# Altium schematic sheet VFD LCD.SchDoc
size A3; SheetNumber: 1; SheetTotal: 3
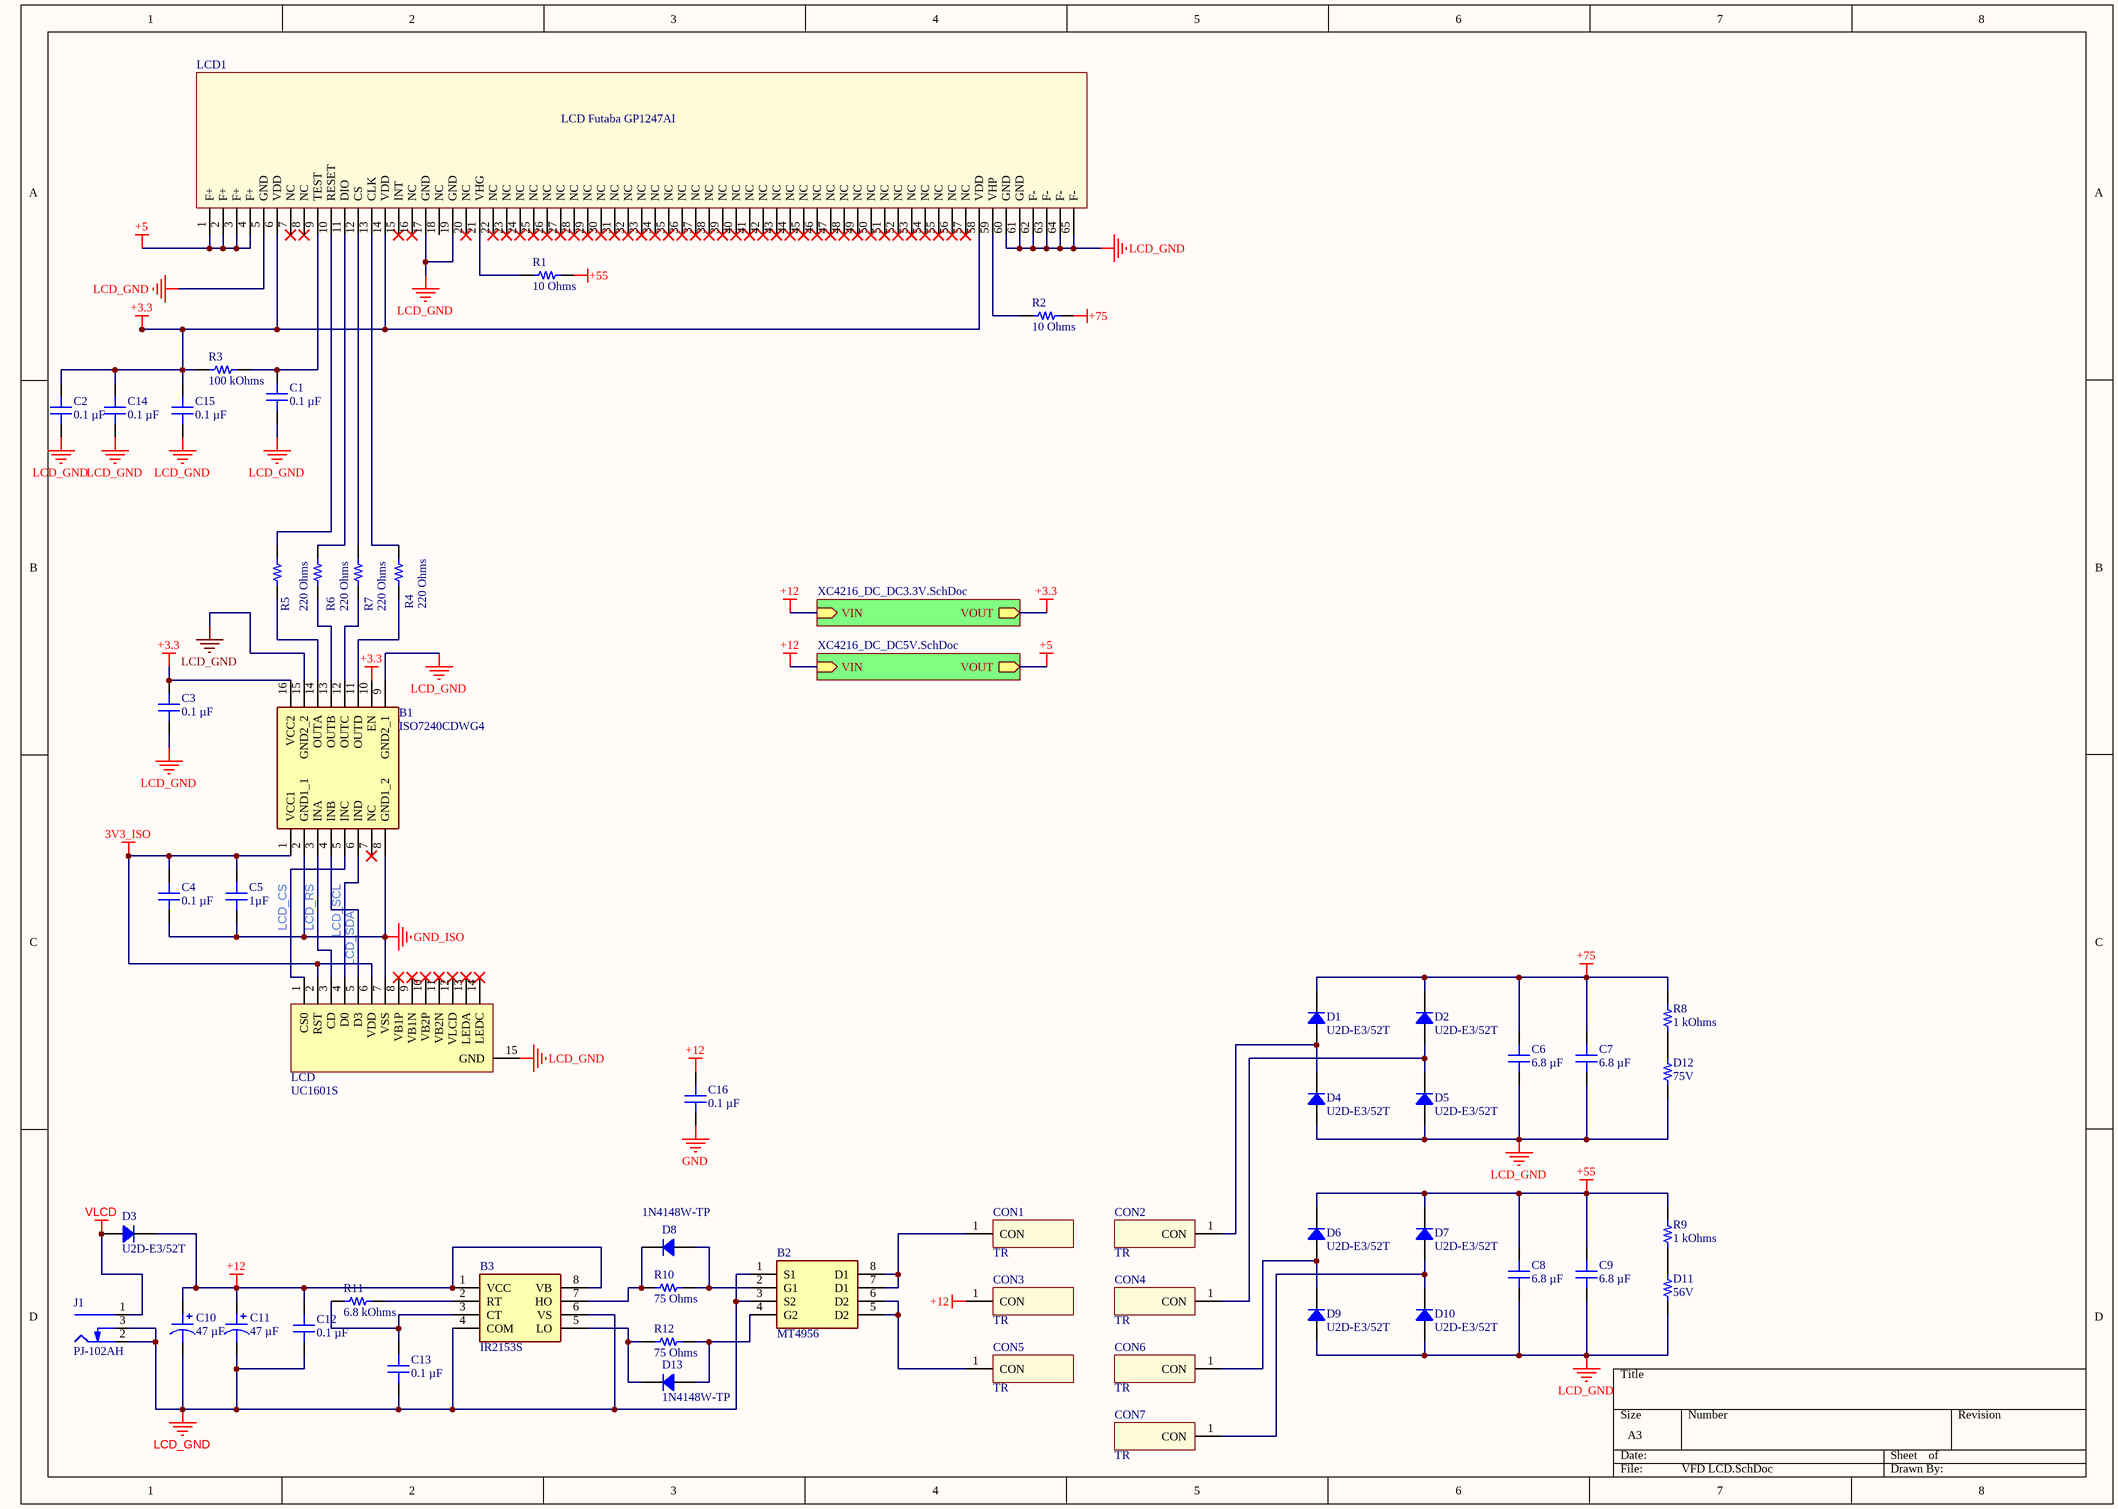
[diagram p0: VFD LCD.SchDoc]

## Parts
B1  ISO7240CDWG4  [SOIC127P1030X265-16N]
B2  MT4956  [SOIC127P600X175-8N]
B3  IR2153S  [SOIC127P600X175-8N]
C1  0.1 µF  [CAP 0805_2012]
C2  0.1 µF  [CAP 0805_2012]
C3  0.1 µF  [CAP 0805_2012]
C4  0.1 µF  [CAP 0805_2012]
C5  1µF  [CAP 0805_2012]
C6  6.8 µF  [CAP 1210_3225 - 1MM]
C7  6.8 µF  [CAP 1210_3225 - 1MM]
C8  6.8 µF  [CAP 1210_3225 - 1MM]
C9  6.8 µF  [CAP 1210_3225 - 1MM]
C10  47 µF  [CAP ALSMD 8.3MM H10.5MM]
C11  47 µF  [CAP ALSMD 8.3MM H10.5MM]
C12  0.1 µF  [CAP 1206_3216 - 0.8MM]
C13  0.1 µF  [CAP 1206_3216 - 0.8MM]
C14  0.1 µF  [CAP 0805_2012]
C15  0.1 µF  [CAP 0805_2012]
C16  0.1 µF  [CAP 1206_3216 - 0.8MM]
CON1  TR  [one contact 0,8_1.6]
CON2  TR  [one contact 0,8_1.6]
CON3  TR  [one contact 0,8_1.6]
CON4  TR  [one contact 0,8_1.6]
CON5  TR  [one contact 0,8_1.6]
CON6  TR  [one contact 0,8_1.6]
CON7  TR  [one contact 0,8_1.6]
D1  U2D-E3/52T  [DO214AA SMB]
D2  U2D-E3/52T  [DO214AA SMB]
D3  U2D-E3/52T  [DO214AA SMB]
D4  U2D-E3/52T  [DO214AA SMB]
D5  U2D-E3/52T  [DO214AA SMB]
D6  U2D-E3/52T  [DO214AA SMB]
D7  U2D-E3/52T  [DO214AA SMB]
D8  1N4148W-TP  [SOD-123]
D9  U2D-E3/52T  [DO214AA SMB]
D10  U2D-E3/52T  [DO214AA SMB]
D11  56V  [RES 1206_3216]
D12  75V  [RES 1206_3216]
D13  1N4148W-TP  [SOD-123]
J1  PJ-102AH  [CUI PJ-102AH]
LCD  UC1601S  [FPC0514]
LCD1  GP1247AI  [GP1247AI]  (value not drawn)
R1  10 Ohms  [RES 1206_3216]
R2  10 Ohms  [RES 1206_3216]
R3  100 kOhms  [RES 0805_2012]
R4  220 Ohms  [RES 0805_2012]
R5  220 Ohms  [RES 0805_2012]
R6  220 Ohms  [RES 0805_2012]
R7  220 Ohms  [RES 0805_2012]
R8  1 kOhms  [RES 1206_3216]
R9  1 kOhms  [RES 1206_3216]
R10  75 Ohms  [RES 0805_2012]
R11  6.8 kOhms  [RES 1206_3216]
R12  75 Ohms  [RES 0805_2012]

## Sub-sheets
U_XC4216_DC_DC3.3V = XC4216_DC_DC3.3V.SchDoc: VIN (in), VOUT (out)
U_XC4216_DC_DC5V = XC4216_DC_DC5V.SchDoc: VIN (in), VOUT (out)

## Nets
3V3_ISO: B1.1(VCC1) C4.1 C5.2 LCD.2(RST) LCD.6(VDD)
+3.3: B1.10(EN) B1.16(VCC2) C2.2 C3.1 C14.2 C15.2 LCD1.6(VDD) LCD1.14(VDD) LCD1.58(VDD) R3.1 ; sheet U_XC4216_DC_DC3.3V/VOUT
+5: LCD1.1(F+) LCD1.2(F+) LCD1.3(F+) LCD1.4(F+) ; sheet U_XC4216_DC_DC5V/VOUT
+12: B3.1(VCC) B3.8(VB) C10.1 C11.1 C12.2 C16.2 CON3.1(CON) D3.2 ; sheet U_XC4216_DC_DC3.3V/VIN, sheet U_XC4216_DC_DC5V/VIN
+55: C8.2 C9.2 D6.2 D7.2 R1.2 R9.2
+75: C6.2 C7.2 D1.2 D2.2 R2.2 R8.2
GND: C16.1
GND_ISO: B1.2(GND1_1) B1.8(GND1_2) C4.2 C5.1 LCD.7(VSS)
LCD_GND: B1.9(GND2_1) B1.15(GND2_2) B2.1(S1) B2.3(S2) B3.4(COM) B3.6(VS) C1.1 C2.1 C3.2 C6.1 C7.1 C8.1 C9.1 C10.2 C11.2 C12.1 C13.1 C14.1 C15.1 D4.1 D5.1 D9.1 D10.1 D11.1 D12.1 J1.2(Outer) J1.3(SW) LCD.15(GND) LCD1.5(GND) LCD1.17(GND) LCD1.19(GND) LCD1.60(GND) LCD1.61(GND) LCD1.62(F-) LCD1.63(F-) LCD1.64(F-) LCD1.65(F-)
VLCD: D3.1 J1.1(Centre)
LCD_CS: B1.5(INC) LCD.1(CS0)
LCD_RS: B1.3(INA) LCD.3(CD)
LCD_SCL: B1.6(IND) LCD.4(D0)
LCD_SDA: B1.4(INB) LCD.5(D3)
NetB1_11: B1.11(OUTD) R4.1
NetB1_12: B1.12(OUTC) R7.1
NetB1_13: B1.13(OUTB) R6.1
NetB1_14: B1.14(OUTA) R5.1
NetB2_2: B2.2(G1) D8.1 R10.2
NetB2_4: B2.4(G2) D13.1 R12.2
NetB2_5: B2.5(D2) B2.6(D2) CON5.1(CON)
NetB2_7: B2.7(D1) B2.8(D1) CON1.1(CON)
NetB3_2: B3.2(RT) R11.2
NetB3_3: B3.3(CT) C13.2 R11.1
NetB3_5: B3.5(LO) D13.2 R12.1
NetB3_7: B3.7(HO) D8.2 R10.1
NetC1_2: C1.2 LCD1.9(TEST) R3.2
NetCON2_1: CON2.1(CON) D1.1 D4.2
NetCON4_1: CON4.1(CON) D2.1 D5.2
NetCON6_1: CON6.1(CON) D6.1 D9.2
NetCON7_1: CON7.1(CON) D7.1 D10.2
NetD11_2: D11.2 R9.1
NetD12_2: D12.2 R8.1
NetLCD1_10: LCD1.10(RESET) R5.2
NetLCD1_11: LCD1.11(DIO) R6.2
NetLCD1_12: LCD1.12(CS) R7.2
NetLCD1_13: LCD1.13(CLK) R4.2
NetLCD1_21: LCD1.21(VHG) R1.1
NetLCD1_59: LCD1.59(VHP) R2.1

Not connected (* = marked no-connect by the designer): B1 7(NC)*; LCD 8(VB1P)* 9(VB1N)* 10(VB2P)* 11(VB2N)* 12(VLCD)* 13(LEDA)* 14(LEDC)*; LCD1 7(NC)* 8(NC)* 15(INT)* 16(NC)* 18(NC) 20(NC)* 22(NC)* 23(NC)* 24(NC)* 25(NC)* 26(NC)* 27(NC)* 28(NC)* 29(NC)* 30(NC)* 31(NC)* 32(NC)* 33(NC)* 34(NC)* 35(NC)* 36(NC)* 37(NC)* 38(NC)* 39(NC)* 40(NC)* 41(NC)* 42(NC)* 43(NC)* 44(NC)* 45(NC)* 46(NC)* 47(NC)* 48(NC)* 49(NC)* 50(NC)* 51(NC)* 52(NC)* 53(NC)* 54(NC)* 55(NC)* 56(NC)* 57(NC)*

## Notes on the sheet
- (in symbol GP1247AI) LCD Futaba GP1247AI

## Library data of the parts
B1 = ISO7240CDWG4: Digital Isolator CMOS 4-CH 25Mbps 16-Pin SOIC Tube; Manufacturer_Name: Texas Instruments; Geometry.Height: 2.65mm; Manufacturer_Part_Number: ISO7240CDWG4; Mouser Part Number: 595-ISO7240CDWG4; Mouser Price/Stock: https://www.mouser.co.uk/ProductDetail/Texas-Instruments/ISO7240CDWG4?qs=IUbkBnfnSQLQBn7aUd6cPA%3D%3D; Arrow Part Number: ISO7240CDWG4; Arrow Price/Stock: https://www.arrow.com/en/products/iso7240cdwg4/texas-instruments; Datasheet Link: https://www.ti.com/lit/ds/symlink/iso7240c.pdf?ts=1635751768423&ref_url=https%253A%252F%252Fwww.ti.com%252Fproduct%252FISO7240C
B2 = MT4956: N-Channel PowerTrench® MOSFET / 60V, 5A, mΩ; Manufacturer_Name: Infineon; Manufacturer_Part_Number: IR2153S; Geometry.Height: 1.75mm; Mouser Part Number: *; Mouser Price/Stock: *; Arrow Part Number: *; Arrow Price/Stock: *; Datasheet Link: http://www.infineon.com/dgdl/ir2153.pdf?fileId=5546d462533600a4015355c8c5fc16af
B3 = IR2153S: Self-Oscillating 600 V Half Bridge Driver IC with typical 0 A source and 0 A sink currents in 8 Lead SOIC package for IGBTs and MOSFETs. Also available in 8 Lead PDIP.; Manufacturer_Name: Infineon; Geometry.Height: 1.75mm; Manufacturer_Part_Number: IR2153S; Mouser Part Number: *; Mouser Price/Stock: *; Arrow Part Number: *; Arrow Price/Stock: *; Datasheet Link: http://www.infineon.com/dgdl/ir2153.pdf?fileId=5546d462533600a4015355c8c5fc16af
C1-C4 C14 C15 = CC0805MRX7R9BB104: CAP CER 0.1UF 50V X7R 0805; manufacturer: Yageo; Tolerance: ±20%; Part Number: CC0805MRX7R9BB104; Value: 0.1 µF; Applications: General Purpose; Capacitance: 0.1 µF; componentlink1description: Datasheet; componentlink1url: https://www.yageo.com/upload/media/product/productsearch/datasheet/mlcc/UPY-GPHC_X7R_6.3V-to-50V_18.pdf; componentlink2description: DigiKey Link; componentlink2url: https://www.digikey.com/en/products/detail/yageo/CC0805MRX7R9BB104/5884281; Device Package: 0805 (2012 Metric); lastupdated: 8/26/2023 7:12:59 PM; Lifecycle Status: Active; Minimum Order: 1; Mounting Type: Surface Mount, MLCC; Operating Temperature: -55°C ~ 125°C; Package / Case: 0805 (2012 Metric); packaging: TapeAndReel; partid: 2475; Part Status: Active; price: 0.01; series: CC; Size / Dimension: 0.079" L x 0.049" W (2.00mm x 1.25mm); Supplier 1: DigiKey; Supplier Part Number 1: 311-4351-1-ND; Temperature Coefficient: X7R; Thickness (Max): 0.037" (0.95mm); Voltage - Rated: 50V
C5 = MM05ZC105KCZ2A: CAP CER 1UF 10V X7R 0805; manufacturer: AVX Corporation; Tolerance: ±10%; Part Number: MM05ZC105KCZ2A; Value: 1µF; Applications: Medical, Non-Critical; Capacitance: 1µF; componentlink1description: Datasheet; componentlink1url: http://datasheets.avx.com/AVX-MM.pdf; componentlink2description: DigiKey Link; componentlink2url: http://digikey.com/product-detail/en/avx-corporation/MM05ZC105KCZ2A/478-10611-1-ND/7344872; Device Package: 0805 (2012 Metric); lastupdated: 9/2/2020 1:04:42 AM; Lifecycle Status: Active; Minimum Order: 1; Mounting Type: Surface Mount, MLCC; Operating Temperature: -55°C ~ 125°C; Package / Case: 0805 (2012 Metric); packaging: TapeAndReel; partid: 2439; Part Status: Active; price: 0.50; series: MM; Size / Dimension: 0.079" L x 0.049" W (2.01mm x 1.25mm); Supplier 1: DigiKey; Supplier Part Number 1: 478-10611-1-ND; Temperature Coefficient: X7R; Thickness (Max): 0.029" (0.74mm); Voltage - Rated: 10V
C6-C9 = CGA6P3X7S1H685K250AB: CAP CER 6.8UF 50V X7S 1210; manufacturer: TDK Corporation; Tolerance: ±10%; Part Number: CGA6P3X7S1H685K250AB; Value: 6.8 µF; Applications: Automotive; Capacitance: 6.8 µF; componentlink1description: Datasheet; componentlink1url: https://product.tdk.com/info/en/catalog/datasheets/mlcc_automotive_general_en.pdf?ref_disty=digikey; componentlink2description: DigiKey Link; componentlink2url: https://www.digikey.com/en/products/detail/tdk-corporation/CGA6P3X7S1H685K250AB/2672896; Device Package: 1210 (3225 Metric); lastupdated: 6/4/2024 7:21:03 PM; Lifecycle Status: Active; Minimum Order: 1; Mounting Type: Surface Mount, MLCC; Operating Temperature: -55°C ~ 125°C; Package / Case: 1210 (3225 Metric); packaging: TapeAndReel; partid: 23852; Part Status: Active; price: 0.32; Ratings: AEC-Q200; series: CGA; Size / Dimension: 0.126" L x 0.098" W (3.20mm x 2.50mm); Supplier 1: DigiKey; Supplier Part Number 1: 445-7003-1-ND; Temperature Coefficient: X7S; Thickness (Max): 0.110" (2.80mm); Voltage - Rated: 50V
C10 C11 = 63SGV47M8X10.5: CAP ALUM 47UF 20% 63V SMD; manufacturer: Rubycon; Lifetime @ Temp.: 2000 Hrs @ 105°C; Polarization: Polar; Ripple Current @ High Frequency: 180 mA @ 10 kHz; Ripple Current @ Low Frequency: 120 mA @ 120 Hz; Surface Mount Land Size: 0.327" L x 0.327" W (8.30mm x 8.30mm); Part Number: 63SGV47M8X10.5; Applications: Automotive; Capacitance: 47 µF; componentlink1description: Datasheet; componentlink1url: http://www.rubycon.co.jp/en/catalog/e_pdfs/aluminum/e_sgv.pdf; componentlink2description: DigiKey Link; componentlink2url: https://www.digikey.com/en/products/detail/rubycon/63SGV47M8X10-5/3568703; Device Package: Radial, Can - SMD; Height - Seated (Max): 0.413" (10.50mm); lastupdated: 8/26/2023 8:37:59 PM; Lifecycle Status: Active; Minimum Order: 1; Mounting Type: Surface Mount; Operating Temperature: -40°C ~ 105°C; Package / Case: Radial, Can - SMD; packaging: TapeAndReel; partid: 7644; Part Status: Active; price: 0.20; Ratings: AEC-Q200; series: SGV; Size / Dimension: 0.315" Dia (8.00mm); Supplier 1: DigiKey; Supplier Part Number 1: 1189-2505-1-ND; Tolerance: ±20%; value: 47 µF; Voltage - Rated: 63 V
C12 C13 C16 = CC1206MRY5V9BB104: CAP CER 0.1UF 50V Y5V 1206; manufacturer: Yageo; Temperature Coefficient: Y5V (F); Tolerance: ±20%; Part Number: CC1206MRY5V9BB104; Value: 0.1 µF; Applications: General Purpose; Capacitance: 0.1 µF; componentlink1description: Datasheet; componentlink1url: http://www.yageo.com/documents/recent/UPY-GPHC_Y5V_6.3V-to-50V_8.pdf; componentlink2description: DigiKey Link; componentlink2url: https://www.digikey.com/en/products/detail/yageo/CC1206MRY5V9BB104/5884674; Device Package: 1206 (3216 Metric); lastupdated: 6/4/2024 7:10:39 PM; Lifecycle Status: Active; Minimum Order: 1; Mounting Type: Surface Mount, MLCC; Operating Temperature: -30°C ~ 85°C; Package / Case: 1206 (3216 Metric); packaging: TapeAndReel; partid: 18711; Part Status: Active; price: 0.04; series: CC; Size / Dimension: 0.126" L x 0.063" W (3.20mm x 1.60mm); Supplier 1: DigiKey; Supplier Part Number 1: 311-4504-1-ND; Thickness (Max): 0.028" (0.70mm); Voltage - Rated: 50V
CON1-CON7 = ONE_Contact
D1-D7 D9 D10 = U2D-E3/52T: DIODE GEN PURP 200V 2A DO214AA; Manufacturer: Vishay Semiconductor Diodes Division; Current - Reverse Leakage @ Vr: 10µA @ 200V; Diode Type: Standard; Reverse Recovery Time (trr): 27ns; Speed: Fast Recovery =< 500ns, > 200mA (Io); Voltage - Forward (Vf) (Max) @ If: 900mV @ 2A; Part Number: U2D-E3/52T; ComponentLink1Description: Datasheet; ComponentLink1URL: http://www.vishay.com/docs/89096/u2d.pdf; ComponentLink2Description: DigiKey Link; ComponentLink2URL: http://digikey.com/product-detail/en/vishay-semiconductor-diodes-division/U2D-E3-52T/U2D-E3-52TGICT-ND/9601335; Current - Average Rectified (Io): 2A; LastUpdated: 6/3/2024 7:53:59 PM; Lifecycle Status: Active; Minimum Order: 1; Mounting Type: Surface Mount; Operating Temperature - Junction: -55°C ~ 150°C; Package / Case: DO-214AA, SMB; Packaging: TapeAndReel; PartId: 160; Part Status: Active; Price: 0.19; Series: -; Supplier 1: DigiKey; Supplier Part Number 1: U2D-E3/52TGICT-ND; Supplier Device Package: DO-214AA (SMB); Voltage - DC Reverse (Vr) (Max): 200V
D8 D13 = 1N4148W-TP: DIODE GEN PURP 100V 150MA SOD123; Manufacturer: Micro Commercial Co; Capacitance @ Vr, F: 2pF @ 0V, 1MHz; Current - Reverse Leakage @ Vr: 1 µA @ 75 V; Diode Type: Standard; Reverse Recovery Time (trr): 4 ns; Speed: Small Signal =< 200mA (Io), Any Speed; Voltage - Forward (Vf) (Max) @ If: 1.25 V @ 150 mA; Part Number: 1N4148W-TP; ComponentLink1Description: Datasheet; ComponentLink1URL: https://www.mccsemi.com/pdf/Products/1N4148W(SOD123).pdf; ComponentLink2Description: DigiKey Link; ComponentLink2URL: https://www.digikey.com/en/products/detail/micro-commercial-co/1N4148W-TP/717196; Current - Average Rectified (Io): 150mA; LastUpdated: 6/3/2024 19:54:46; Lifecycle Status: Active; Minimum Order: 1; Mounting Type: Surface Mount; Operating Temperature - Junction: -65°C ~ 150°C; Package / Case: SOD-123; Packaging: TapeAndReel; PartId: 999; Part Status: Active; Price: 0.01; Series: -; Supplier 1: DigiKey; Supplier Part Number 1: 1N4148WTPMSCT-ND; Supplier Device Package: SOD-123; Voltage - DC Reverse (Vr) (Max): 100 V
D11 D12 = RNCS1206BKE1K00: RES 1K OHM 0.1% 1/8W 1206; Manufacturer: Stackpole Electronics Inc; Power (Watts): 0.125W, 1/8W; Resistance: 1 kOhms; Temperature Coefficient: ±25ppm/°C; Value: 1 kOhms; Part Number: RNCS1206BKE1K00; ComponentLink1Description: Datasheet; ComponentLink1URL: https://www.seielect.com/catalog/sei-rncs_rnch.pdf; ComponentLink2Description: DigiKey Link; ComponentLink2URL: https://www.digikey.com/en/products/detail/stackpole-electronics-inc/RNCS1206BKE1K00/1800333; Composition: Thin Film; Device Package: 1206 (3216 Metric); Features: Anti-Corrosive, Automotive AEC-Q200, Moisture Resistant; Height - Seated (Max): 0.026" (0.65mm); LastUpdated: 2/9/2024 8:54:46 PM; Lifecycle Status: Active; Minimum Order: 1; Number of Terminations: 2; Operating Temperature: -55°C ~ 155°C; Package / Case: 1206 (3216 Metric); Packaging: TapeAndReel; PartId: 26856; Part Status: Active; Price: 0.08; Ratings: AEC-Q200; Series: RNCS; Size / Dimension: 0.120" L x 0.061" W (3.05mm x 1.55mm); Supplier 1: DigiKey; Supplier Part Number 1: RNCS1206BKE1K00CT-ND; Supplier Device Package: 1206; Tolerance: ±0.1%
J1 = PJ-102AH: CONN PWR JACK 2X5.5MM SOLDER; Manufacturer: CUI Devices; Actual Diameter: 0.079" (2.00mm ID), 0.256" (6.50mm OD); Current Rating (Amps): 5A; Gender: Male; Industry Recognized Mating Diameter: 2.00mm ID (0.079"), 5.50mm OD (0.217"); Internal Switch(s): Single Switch, Normally Closed; Material Flammability Rating: UL94 V-0; Mating Length/Depth: 0.354" (9.00mm); Number of Positions/Contacts: 2 Conductors, 3 Contacts; Shielding: Unshielded; Voltage - Rated: 24VDC; System: Connector; Part Number: PJ-102AH; ComponentLink1Description: Datasheet; ComponentLink1URL: https://www.cuidevices.com/product/resource/digikeypdf/pj-102ah.pdf; ComponentLink2Description: DigiKey Link; ComponentLink2URL: //digikey.com/product-detail/en/cui-devices/PJ-102AH/CP-102AH-ND/408448; Connector Type: Jack; LastUpdated: 12/16/2019 7:01:27 PM; Lifecycle Status: 0; Minimum Order: 1; Mounting Type: Through Hole, Right Angle; Packaging: Tray; Part Status: Active; Price: 0.76; Series: -; Supplier 1: DigiKey; Supplier Part Number 1: CP-102AH-ND; Termination: Solder
LCD = UC1601S: LCD 65*132; System: connector
R1 R2 = RNCS1206BKE10R0: RES 10 OHM 0.1% 1/8W 1206; Manufacturer: Stackpole Electronics Inc; Power (Watts): 0.125W, 1/8W; Temperature Coefficient: ±25ppm/°C; Part Number: RNCS1206BKE10R0; ComponentLink1Description: Datasheet; ComponentLink1URL: https://www.seielect.com/catalog/sei-rncs_rnch.pdf; ComponentLink2Description: DigiKey Link; ComponentLink2URL: https://www.digikey.com/en/products/detail/stackpole-electronics-inc/RNCS1206BKE10R0/1801459; Composition: Thin Film; Device Package: 1206 (3216 Metric); Features: Anti-Corrosive, Automotive AEC-Q200, Moisture Resistant; Height - Seated (Max): 0.026" (0.65mm); LastUpdated: 2/9/2024 8:54:46 PM; Lifecycle Status: Active; Minimum Order: 1; Number of Terminations: 2; Operating Temperature: -55°C ~ 155°C; Package / Case: 1206 (3216 Metric); Packaging: TapeAndReel; PartId: 26855; Part Status: Active; Price: 0.08; Ratings: AEC-Q200; Resistance: 10 Ohms; Series: RNCS; Size / Dimension: 0.120" L x 0.061" W (3.05mm x 1.55mm); Supplier 1: DigiKey; Supplier Part Number 1: RNCS1206BKE10R0CT-ND; Supplier Device Package: 1206; Tolerance: ±0.1%; Value: 10 Ohms
R3 = CPF0805B100KE: RES SMD 100K OHM 0.1% 1/10W 0805; Manufacturer: TE Connectivity Passive Product; Power (Watts): 0.1W, 1/10W; Temperature Coefficient: ±25ppm/°C; Part Number: CPF0805B100KE; Value: 100 kOhms; ComponentLink1Description: Datasheet; ComponentLink1URL: https://www.te.com/commerce/DocumentDelivery/DDEController?Action=srchrtrv&DocNm=1773200&DocType=DS&DocLang=English; ComponentLink2Description: DigiKey Link; ComponentLink2URL: https://www.digikey.com/en/products/detail/te-connectivity-passive-product/CPF0805B100KE/2389788; Composition: Thin Film; Device Package: 0805 (2012 Metric); Height - Seated (Max): 0.026" (0.65mm); LastUpdated: 8/26/2023 7:54:23 PM; Lifecycle Status: Active; Minimum Order: 1; Number of Terminations: 2; Operating Temperature: -55°C ~ 155°C; Package / Case: 0805 (2012 Metric); Packaging: TapeAndReel; PartId: 27729; Part Status: Active; Price: 0.09; Resistance: 100 kOhms; Series: CPF, Neohm; Size / Dimension: 0.079" L x 0.049" W (2.00mm x 1.25mm); Supplier 1: DigiKey; Supplier Part Number 1: A106042CT-ND; Supplier Device Package: 0805; Tolerance: ±0.1%
R4-R7 = CRGP0805F220R: RES 220 OHM 1% 1/3W 0805; Manufacturer: TE Connectivity Passive Product; Power (Watts): 0.333W, 1/3W; Temperature Coefficient: ±100ppm/°C; Part Number: CRGP0805F220R; Value: 220 Ohms; ComponentLink1Description: Datasheet; ComponentLink1URL: https://www.te.com/commerce/DocumentDelivery/DDEController?Action=srchrtrv&DocNm=9-1773463-9&DocType=DS&DocLang=English; ComponentLink2Description: DigiKey Link; ComponentLink2URL: https://www.digikey.com/en/products/detail/te-connectivity-passive-product/CRGP0805F220R/8577071; Composition: Thick Film; Device Package: 0805 (2012 Metric); Features: Pulse Withstanding; Height - Seated (Max): 0.026" (0.65mm); LastUpdated: 8/26/2023 7:54:19 PM; Lifecycle Status: Active; Minimum Order: 1; Number of Terminations: 2; Operating Temperature: -55°C ~ 155°C; Package / Case: 0805 (2012 Metric); Packaging: TapeAndReel; PartId: 28799; Part Status: Active; Price: 0.02; Resistance: 220 Ohms; Series: CRGP; Size / Dimension: 0.079" L x 0.049" W (2.00mm x 1.25mm); Supplier 1: DigiKey; Supplier Part Number 1: A130469CT-ND; Supplier Device Package: 0805; Tolerance: ±1%
R8 R9 = RNCS1206BKE1K00: RES 1K OHM 0.1% 1/8W 1206; Manufacturer: Stackpole Electronics Inc; Power (Watts): 0.125W, 1/8W; Temperature Coefficient: ±25ppm/°C; Part Number: RNCS1206BKE1K00; ComponentLink1Description: Datasheet; ComponentLink1URL: https://www.seielect.com/catalog/sei-rncs_rnch.pdf; ComponentLink2Description: DigiKey Link; ComponentLink2URL: https://www.digikey.com/en/products/detail/stackpole-electronics-inc/RNCS1206BKE1K00/1800333; Composition: Thin Film; Device Package: 1206 (3216 Metric); Features: Anti-Corrosive, Automotive AEC-Q200, Moisture Resistant; Height - Seated (Max): 0.026" (0.65mm); LastUpdated: 2/9/2024 8:54:46 PM; Lifecycle Status: Active; Minimum Order: 1; Number of Terminations: 2; Operating Temperature: -55°C ~ 155°C; Package / Case: 1206 (3216 Metric); Packaging: TapeAndReel; PartId: 26856; Part Status: Active; Price: 0.08; Ratings: AEC-Q200; Resistance: 1 kOhms; Series: RNCS; Size / Dimension: 0.120" L x 0.061" W (3.05mm x 1.55mm); Supplier 1: DigiKey; Supplier Part Number 1: RNCS1206BKE1K00CT-ND; Supplier Device Package: 1206; Tolerance: ±0.1%; Value: 1 kOhms
R10 R12 = CPF0805B7R5E1: RES SMD 7.5 OHM 0.1% 1/10W 0805; Manufacturer: TE Connectivity Passive Product; Power (Watts): 0.1W, 1/10W; Resistance: 7.5 Ohms; Temperature Coefficient: ±25ppm/°C; Part Number: CPF0805B7R5E1; Value: 75 Ohms; ComponentLink1Description: Datasheet; ComponentLink1URL: https://www.te.com/commerce/DocumentDelivery/DDEController?Action=srchrtrv&DocNm=1773200&DocType=DS&DocLang=English; ComponentLink2Description: DigiKey Link; ComponentLink2URL: https://www.digikey.com/en/products/detail/te-connectivity-passive-product/CPF0805B7R5E1/2381982; Composition: Thin Film; Device Package: 0805 (2012 Metric); Height - Seated (Max): 0.026" (0.65mm); LastUpdated: 2/8/2024 9:02:36 PM; Lifecycle Status: Active; Minimum Order: 1; Number of Terminations: 2; Operating Temperature: -55°C ~ 155°C; Package / Case: 0805 (2012 Metric); Packaging: TapeAndReel; PartId: 28455; Part Status: Active; Price: 0.10; Series: CPF, Neohm; Size / Dimension: 0.079" L x 0.049" W (2.00mm x 1.25mm); Supplier 1: DigiKey; Supplier Part Number 1: A103244CT-ND; Supplier Device Package: 0805; Tolerance: ±0.1%
R11 = ERA-8ARW682V: RES SMD 6.8K OHM 0.05% 1/4W 1206; Manufacturer: Panasonic Electronic Components; Power (Watts): 0.25W, 1/4W; Temperature Coefficient: ±10ppm/°C; Part Number: ERA-8ARW682V; ComponentLink1Description: Datasheet; ComponentLink1URL: https://industrial.panasonic.com/cdbs/www-data/pdf/RDM0000/AOA0000C307.pdf; ComponentLink2Description: DigiKey Link; ComponentLink2URL: https://www.digikey.com/en/products/detail/panasonic-electronic-components/ERA-8ARW682V/5141131; Composition: Thin Film; Device Package: 1206 (3216 Metric); Features: Automotive AEC-Q200; Height - Seated (Max): 0.028" (0.70mm); LastUpdated: 2/9/2024 8:54:41 PM; Lifecycle Status: Active; Minimum Order: 1; Number of Terminations: 2; Operating Temperature: -55°C ~ 155°C; Package / Case: 1206 (3216 Metric); Packaging: TapeAndReel; PartId: 27483; Part Status: Active; Price: 0.53; Ratings: AEC-Q200; Resistance: 6.8 kOhms; Series: ERA-8A; Size / Dimension: 0.126" L x 0.063" W (3.20mm x 1.60mm); Supplier 1: DigiKey; Supplier Part Number 1: P6.8KCTCT-ND; Supplier Device Package: 1206; Tolerance: ±0.05%; Value: 6.8 kOhms